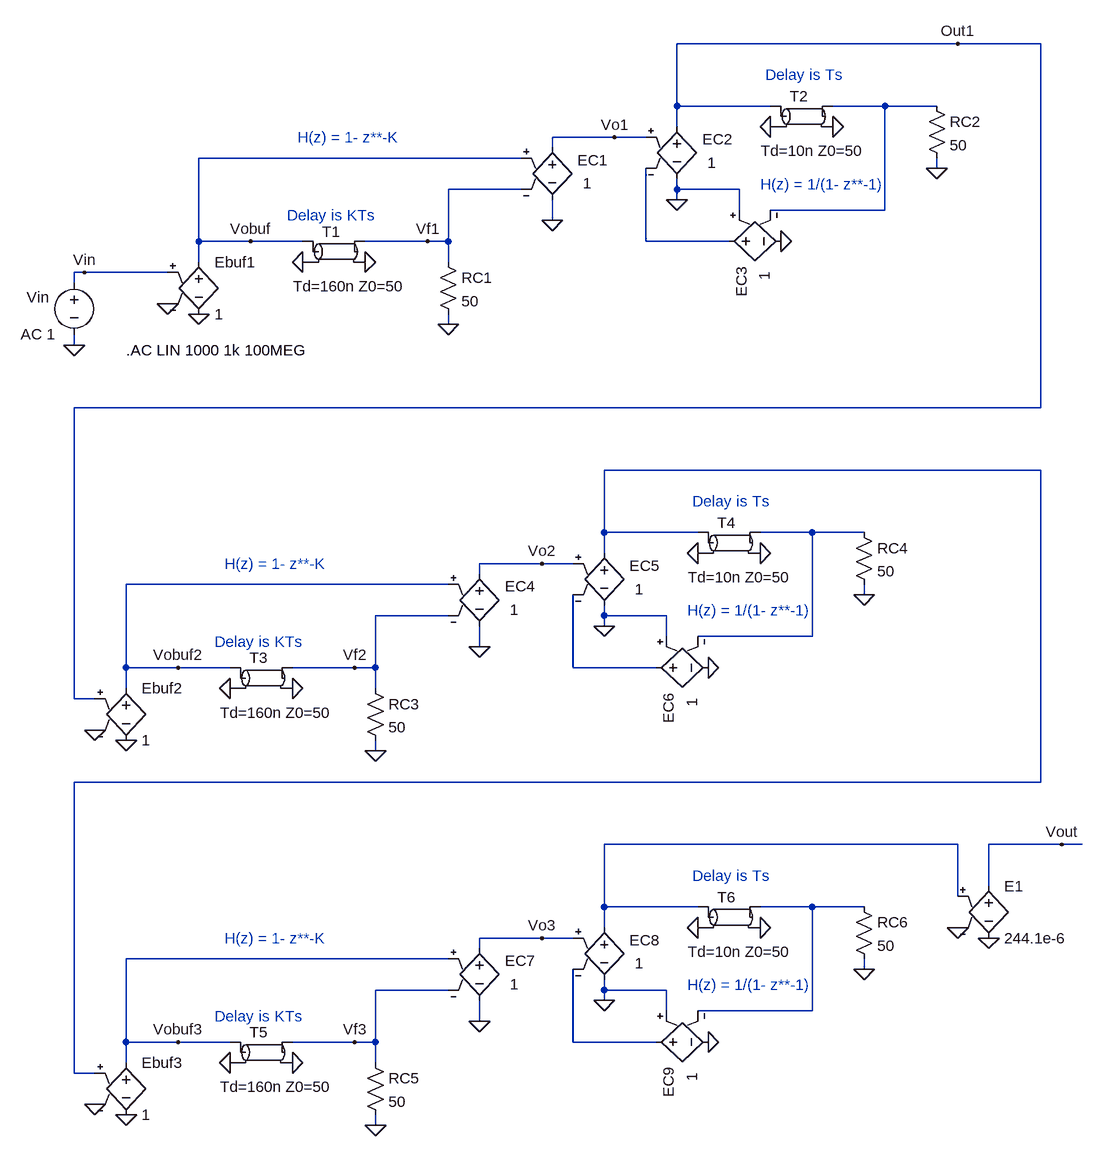
[diagram p0: schematic _Fig4_52_MSD.asc]
_Fig4_52_MSD.asc, the LTspice schematic file:
Version 4
SHEET 1 1656 1508
WIRE 1440 -176 1008 -176
WIRE 1568 -176 1440 -176
WIRE 1008 -80 1008 -176
WIRE 1152 -80 1008 -80
WIRE 1328 -80 1248 -80
WIRE 1408 -80 1328 -80
WIRE 1008 -48 1008 -80
WIRE 912 -32 816 -32
WIRE 960 -32 912 -32
WIRE 816 -16 816 -32
WIRE 768 0 272 0
WIRE 1408 16 1408 0
WIRE 768 48 656 48
WIRE 1008 48 1008 32
WIRE 1104 48 1008 48
WIRE 1008 64 1008 48
WIRE 1104 80 1104 48
WIRE 1328 80 1328 -80
WIRE 1328 80 1152 80
WIRE 816 96 816 64
WIRE 272 128 272 0
WIRE 352 128 272 128
WIRE 432 128 352 128
WIRE 624 128 528 128
WIRE 656 128 656 48
WIRE 656 128 624 128
WIRE 960 128 960 16
WIRE 1088 128 960 128
WIRE 272 160 272 128
WIRE 656 160 656 128
WIRE 96 176 80 176
WIRE 224 176 96 176
WIRE 80 192 80 176
WIRE 656 256 656 240
WIRE 80 288 80 272
WIRE 1568 384 1568 -176
WIRE 1568 384 80 384
WIRE 1568 480 896 480
WIRE 896 576 896 480
WIRE 1040 576 896 576
WIRE 1216 576 1136 576
WIRE 1296 576 1216 576
WIRE 896 608 896 576
WIRE 800 624 704 624
WIRE 848 624 800 624
WIRE 704 640 704 624
WIRE 656 656 160 656
WIRE 1296 672 1296 656
WIRE 656 704 544 704
WIRE 896 704 896 688
WIRE 992 704 896 704
WIRE 896 720 896 704
WIRE 992 736 992 704
WIRE 1216 736 1216 576
WIRE 1216 736 1040 736
WIRE 704 752 704 720
WIRE 160 784 160 656
WIRE 240 784 160 784
WIRE 320 784 240 784
WIRE 512 784 416 784
WIRE 544 784 544 704
WIRE 544 784 512 784
WIRE 848 784 848 672
WIRE 976 784 848 784
WIRE 160 816 160 784
WIRE 544 816 544 784
WIRE 80 832 80 384
WIRE 112 832 80 832
WIRE 544 912 544 896
WIRE 1568 960 1568 480
WIRE 1568 960 80 960
WIRE 1440 1056 896 1056
WIRE 1600 1056 1488 1056
WIRE 1632 1056 1600 1056
WIRE 1488 1120 1488 1056
WIRE 1440 1136 1440 1056
WIRE 896 1152 896 1056
WIRE 1040 1152 896 1152
WIRE 1216 1152 1136 1152
WIRE 1296 1152 1216 1152
WIRE 896 1184 896 1152
WIRE 800 1200 704 1200
WIRE 848 1200 800 1200
WIRE 704 1216 704 1200
WIRE 656 1232 160 1232
WIRE 1296 1248 1296 1232
WIRE 656 1280 544 1280
WIRE 896 1280 896 1264
WIRE 992 1280 896 1280
WIRE 896 1296 896 1280
WIRE 992 1312 992 1280
WIRE 1216 1312 1216 1152
WIRE 1216 1312 1040 1312
WIRE 704 1328 704 1296
WIRE 160 1360 160 1232
WIRE 240 1360 160 1360
WIRE 320 1360 240 1360
WIRE 512 1360 416 1360
WIRE 544 1360 544 1280
WIRE 544 1360 512 1360
WIRE 848 1360 848 1248
WIRE 976 1360 848 1360
WIRE 160 1392 160 1360
WIRE 544 1392 544 1360
WIRE 80 1408 80 960
WIRE 112 1408 80 1408
WIRE 544 1488 544 1472
FLAG 80 288 0
FLAG 96 176 Vin
FLAG 528 160 0
FLAG 432 160 0
FLAG 224 224 0
FLAG 272 240 0
FLAG 352 128 Vobuf
FLAG 656 256 0
FLAG 624 128 Vf1
FLAG 816 96 0
FLAG 912 -32 Vo1
FLAG 1008 64 0
FLAG 1248 -48 0
FLAG 1152 -48 0
FLAG 1408 16 0
FLAG 1168 128 0
FLAG 1440 -176 Out1
FLAG 416 816 0
FLAG 320 816 0
FLAG 112 880 0
FLAG 160 896 0
FLAG 240 784 Vobuf2
FLAG 544 912 0
FLAG 512 784 Vf2
FLAG 704 752 0
FLAG 800 624 Vo2
FLAG 896 720 0
FLAG 1136 608 0
FLAG 1040 608 0
FLAG 1296 672 0
FLAG 1056 784 0
FLAG 1440 1184 0
FLAG 1488 1200 0
FLAG 1600 1056 Vout
FLAG 416 1392 0
FLAG 320 1392 0
FLAG 112 1456 0
FLAG 160 1472 0
FLAG 240 1360 Vobuf3
FLAG 544 1488 0
FLAG 512 1360 Vf3
FLAG 704 1328 0
FLAG 800 1200 Vo3
FLAG 896 1296 0
FLAG 1136 1184 0
FLAG 1040 1184 0
FLAG 1296 1248 0
FLAG 1056 1360 0
SYMBOL tline 480 144 R0
WINDOW 0 -18 -31 Left 0
WINDOW 3 -63 53 Left 0
SYMATTR InstName T1
SYMATTR Value Td=160n Z0=50
SYMBOL voltage 80 176 R0
WINDOW 0 -73 38 Left 0
WINDOW 123 -82 95 Left 0
WINDOW 39 0 0 Left 0
SYMATTR InstName Vin
SYMATTR Value2 AC 1
SYMATTR Value ""
SYMBOL e 272 144 R0
SYMATTR InstName Ebuf1
SYMATTR Value 1
SYMBOL res 640 144 R0
SYMATTR InstName RC1
SYMATTR Value 50
SYMBOL e 816 -32 R0
WINDOW 0 39 35 Left 0
WINDOW 3 47 71 Left 0
SYMATTR InstName EC1
SYMATTR Value 1
SYMBOL e 1008 -64 R0
WINDOW 0 39 35 Left 0
WINDOW 3 47 71 Left 0
SYMATTR InstName EC2
SYMATTR Value 1
SYMBOL e 1072 128 M90
WINDOW 0 39 35 Left 0
WINDOW 3 47 71 Left 0
SYMATTR InstName EC3
SYMATTR Value 1
SYMBOL tline 1200 -64 R0
WINDOW 0 -18 -31 Left 0
WINDOW 3 -63 53 Left 0
SYMATTR InstName T2
SYMATTR Value Td=10n Z0=50
SYMBOL res 1392 -96 R0
SYMATTR InstName RC2
SYMATTR Value 50
SYMBOL tline 368 800 R0
WINDOW 0 -18 -31 Left 0
WINDOW 3 -63 53 Left 0
SYMATTR InstName T3
SYMATTR Value Td=160n Z0=50
SYMBOL e 160 800 R0
SYMATTR InstName Ebuf2
SYMATTR Value 1
SYMBOL res 528 800 R0
SYMATTR InstName RC3
SYMATTR Value 50
SYMBOL e 704 624 R0
WINDOW 0 39 35 Left 0
WINDOW 3 47 71 Left 0
SYMATTR InstName EC4
SYMATTR Value 1
SYMBOL e 896 592 R0
WINDOW 0 39 35 Left 0
WINDOW 3 47 71 Left 0
SYMATTR InstName EC5
SYMATTR Value 1
SYMBOL e 960 784 M90
WINDOW 0 39 35 Left 0
WINDOW 3 47 71 Left 0
SYMATTR InstName EC6
SYMATTR Value 1
SYMBOL tline 1088 592 R0
WINDOW 0 -18 -31 Left 0
WINDOW 3 -63 53 Left 0
SYMATTR InstName T4
SYMATTR Value Td=10n Z0=50
SYMBOL res 1280 560 R0
SYMATTR InstName RC4
SYMATTR Value 50
SYMBOL e 1488 1104 R0
SYMATTR InstName E1
SYMATTR Value 244.1e-6
SYMBOL tline 368 1376 R0
WINDOW 0 -18 -31 Left 0
WINDOW 3 -63 53 Left 0
SYMATTR InstName T5
SYMATTR Value Td=160n Z0=50
SYMBOL e 160 1376 R0
SYMATTR InstName Ebuf3
SYMATTR Value 1
SYMBOL res 528 1376 R0
SYMATTR InstName RC5
SYMATTR Value 50
SYMBOL e 704 1200 R0
WINDOW 0 39 35 Left 0
WINDOW 3 47 71 Left 0
SYMATTR InstName EC7
SYMATTR Value 1
SYMBOL e 896 1168 R0
WINDOW 0 39 35 Left 0
WINDOW 3 47 71 Left 0
SYMATTR InstName EC8
SYMATTR Value 1
SYMBOL e 960 1360 M90
WINDOW 0 39 35 Left 0
WINDOW 3 47 71 Left 0
SYMATTR InstName EC9
SYMATTR Value 1
SYMBOL tline 1088 1168 R0
WINDOW 0 -18 -31 Left 0
WINDOW 3 -63 53 Left 0
SYMATTR InstName T6
SYMATTR Value Td=10n Z0=50
SYMBOL res 1280 1136 R0
SYMATTR InstName RC6
SYMATTR Value 50
TEXT 160 296 Left 0 !.AC LIN 1000 1k 100MEG
TEXT 424 -32 Left 0 ;H(z) = 1- z**-K
TEXT 408 88 Left 0 ;Delay is KTs
TEXT 1144 -128 Left 0 ;Delay is Ts
TEXT 1136 40 Left 0 ;H(z) = 1/(1- z**-1)
TEXT 312 624 Left 0 ;H(z) = 1- z**-K
TEXT 296 744 Left 0 ;Delay is KTs
TEXT 1032 528 Left 0 ;Delay is Ts
TEXT 1024 696 Left 0 ;H(z) = 1/(1- z**-1)
TEXT 312 1200 Left 0 ;H(z) = 1- z**-K
TEXT 296 1320 Left 0 ;Delay is KTs
TEXT 1032 1104 Left 0 ;Delay is Ts
TEXT 1024 1272 Left 0 ;H(z) = 1/(1- z**-1)

The netlist it stands for:
* _Fig4_52_MSD.asc
T1 Vobuf 0 Vf1 0 Td=160n Z0=50
Vin Vin 0 AC 1
Ebuf1 Vobuf 0 Vin 0 1
RC1 Vf1 0 50
EC1 Vo1 0 Vobuf Vf1 1
EC2 Out1 0 Vo1 N002 1
EC3 N002 0 0 N001 1
T2 Out1 0 N001 0 Td=10n Z0=50
RC2 N001 0 50
T3 Vobuf2 0 Vf2 0 Td=160n Z0=50
Ebuf2 Vobuf2 0 Out1 0 1
RC3 Vf2 0 50
EC4 Vo2 0 Vobuf2 Vf2 1
EC5 N003 0 Vo2 N005 1
EC6 N005 0 0 N004 1
T4 N003 0 N004 0 Td=10n Z0=50
RC4 N004 0 50
E1 Vout 0 N006 0 244.1e-6
T5 Vobuf3 0 Vf3 0 Td=160n Z0=50
Ebuf3 Vobuf3 0 N003 0 1
RC5 Vf3 0 50
EC7 Vo3 0 Vobuf3 Vf3 1
EC8 N006 0 Vo3 N008 1
EC9 N008 0 0 N007 1
T6 N006 0 N007 0 Td=10n Z0=50
RC6 N007 0 50
.AC LIN 1000 1k 100MEG
* H(z) = 1- z**-K
* Delay is KTs
* Delay is Ts
* H(z) = 1/(1- z**-1)
* H(z) = 1- z**-K
* Delay is KTs
* Delay is Ts
* H(z) = 1/(1- z**-1)
* H(z) = 1- z**-K
* Delay is KTs
* Delay is Ts
* H(z) = 1/(1- z**-1)
.backanno
.end